# EAGLE design ColinsBlinkySchematic (EAGLE 9.0.0)
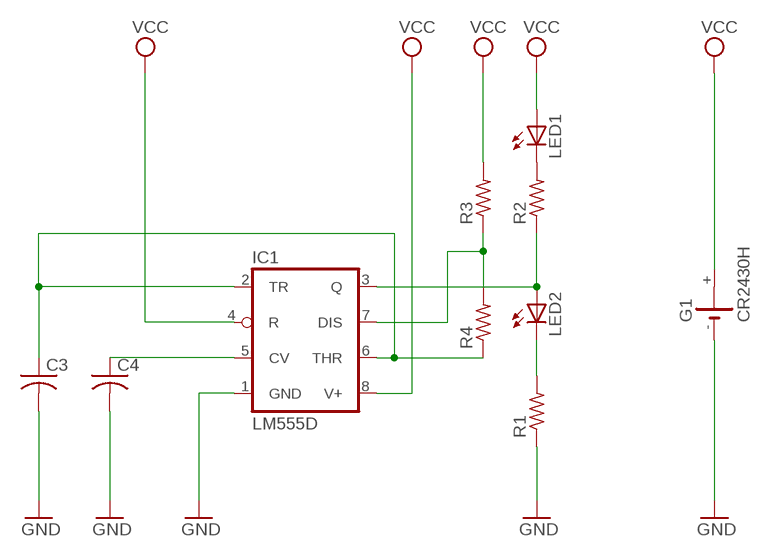
[diagram p0: schematic, sheet 1]

## Parts
C3  C-USC0805  [C0805]
C4  C-USC0805  [C0805]
G1  CR2430H  [CR2430H]
IC1  LM555D  [SO08]
LED1  LED5MM  [LED5MM]
LED2  LED5MM  [LED5MM]
R1  R-US_R0805  [R0805]
R2  R-US_R0805  [R0805]
R3  R-US_R0805  [R0805]
R4  R-US_R0805  [R0805]

## Nets
GND: C3.2 C4.2 G1.- IC1.1(GND) R1.1
N$1: IC1.3(Q) LED2.A R2.1
N$2: LED2.K(C) R1.2
N$4: IC1.7(DIS) R3.1 R4.2
N$5: C4.1 IC1.5(CV)
N$6: C3.1 IC1.2(TR) IC1.6(THR) R4.1
N$8: LED1.K(C) R2.2
VCC: G1.+ IC1.4(R) IC1.8(V+) LED1.A R3.2
Unconnected: G1.+@1(+)

## Library data of the parts
C3 C4 = resistor:C-US: CAPACITOR, American symbol
G1 = battery:CR2430H: LI BATTERY Varta
IC1 = linear:*555: TIMER
LED1 LED2 = led:LED: LED OSRAM: - CHIPLED LG R971, LG N971, LY N971, LG Q971, LY Q971, LO R971, LY R971 LH N974, LH R974 LS Q976, LO Q976, LY Q976 LO Q996 - Hyper CHIPLED LW Q18S LB Q993, LB Q99A, LB R99A - SideLED LS A670, LO A670, LY A670, LG A670, LP A670 LB A673, LV A673, LT A673, LW A673 LH A674 LY A675 LS A676, LA A676, LO A676, LY A676, LW A676 LS A679, LY A679, LG A679 - Hyper Micro SIDELED® LS Y876, LA Y876, LO Y876, LY Y876 LT Y87S - SmartLED LW L88C, LW L88S LB L89C, LB L89S, LG L890 LS L89K, LO L89K, LY L89K LS L896, LA L896, LO L896, LY L896 - TOPLED LS T670, LO T670, LY T670, LG T670, LP T670 LSG T670, LSP T670, LSY T670, LOP T670, LYG T670 LG T671, LOG T671, LSG T671 LB T673, LV T673, LT T673, LW T673 LH T674 LS T676, LA T676, LO T676, LY T676, LB T676, LH T676, LSB T676, LW T676 LB T67C, LV T67C, LT T67C, LS T67K, LO T67K, LY T67K, LW E67C LS E67B, LA E67B, LO E67B, LY E67B, LB E67C, LV E67C, LT E67C LW T67C LS T679, LY T679, LG T679 LS T770, LO T770, LY T770, LG T770, LP T770 LB T773, LV T773, LT T773, LW T773 LH T774 LS E675, LA E675, LY E675, LS T675 LS T776, LA T776, LO T776, LY T776, LB T776 LHGB T686 LT T68C, LB T68C - Hyper Mini TOPLED® LB M676 - Mini TOPLED Santana® LG M470 LS M47K, LO M47K, LY M47K Source: http://www.osram.convergy.de LUXEON: - LUMILED® LXK2-PW12-R00, LXK2-PW12-S00, LXK2-PW14-U00, LXK2-PW14-V00 LXK2-PM12-R00, LXK2-PM12-S00, LXK2-PM14-U00 LXK2-PE12-Q00, LXK2-PE12-R00, LXK2-PE12-S00, LXK2-PE14-T00, LXK2-PE14-U00 LXK2-PB12-K00, LXK2-PB12-L00, LXK2-PB12-M00, LXK2-PB14-N00, LXK2-PB14-P00, LXK2-PB14-Q00 LXK2-PR12-L00, LXK2-PR12-M00, LXK2-PR14-Q00, LXK2-PR14-R00 LXK2-PD12-Q00, LXK2-PD12-R00, LXK2-PD12-S00 LXK2-PH12-R00, LXK2-PH12-S00 LXK2-PL12-P00, LXK2-PL12-Q00, LXK2-PL12-R00 Source: www.luxeon.com KINGBRIGHT: KA-3528ASYC Source: www.kingbright.com
R1-R4 = rcl:R-US_: RESISTOR, American symbol; SPICEPREFIX: R

## Board
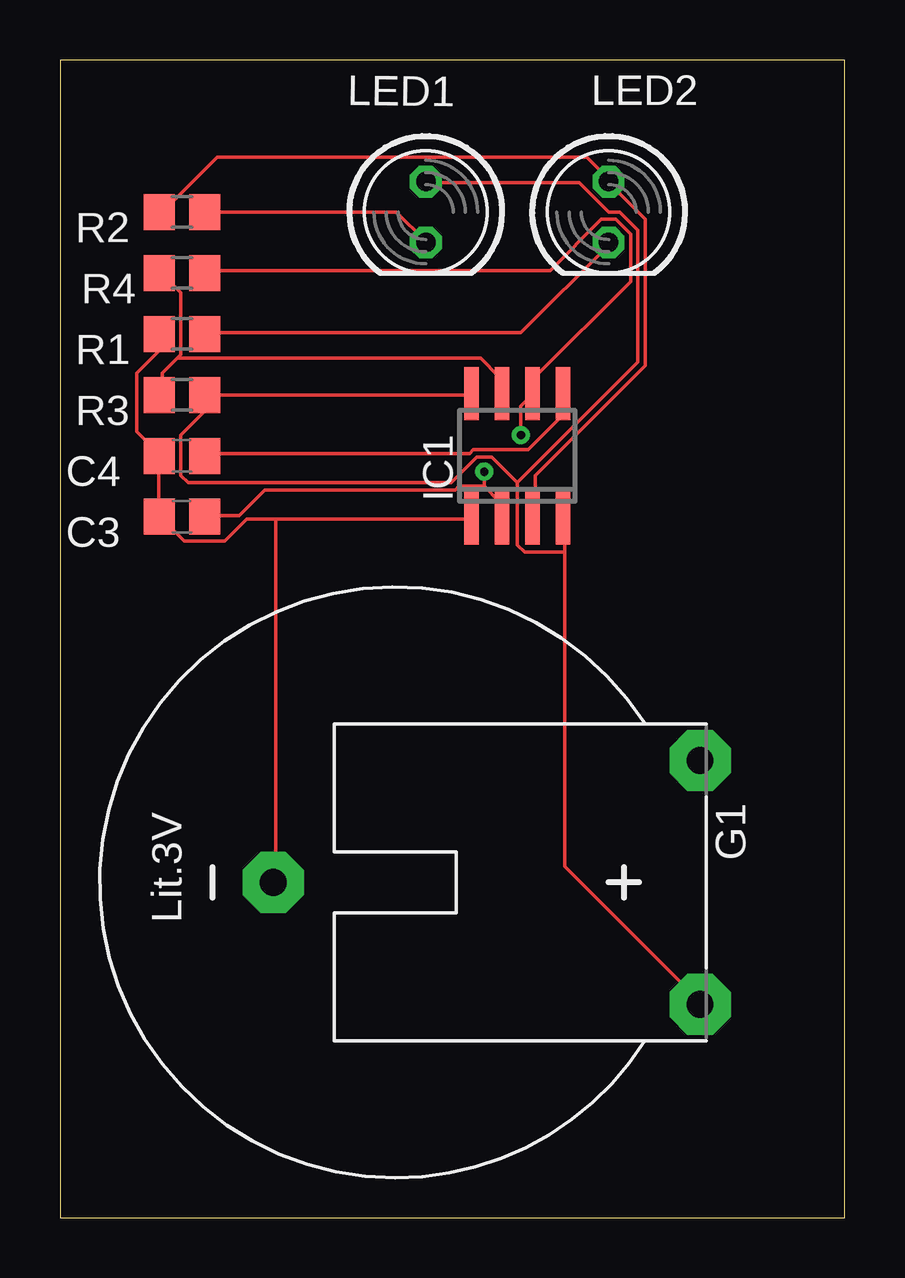
[diagram p1: board, top side]
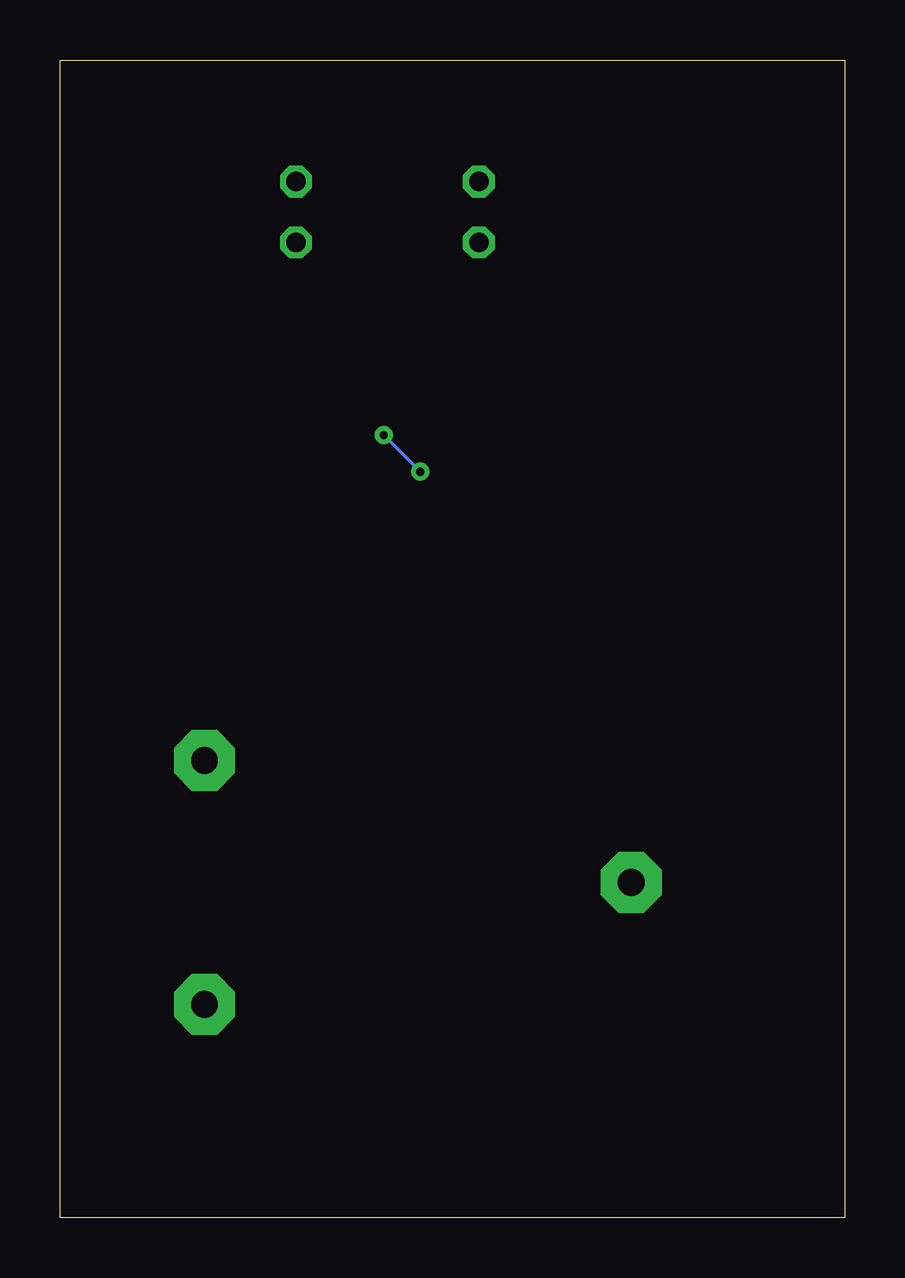
[diagram p2: board, bottom side, seen from below]

Size 32.69 x 48.25 mm. Coordinates in mm from the lower left corner, seen from the top.
Outline: 0,0 32.69,0 32.69,48.25 0,48.25 0,0
Copper layers (1*16): Top 0.035mm / dielectric 1.5mm / Bottom 0.035mm
Design rules "default": minimum track width 6mil, minimum drill 0.35mm, track to track 6mil, track to pad 6mil, pad to pad 6mil, via to via 6mil, smd to smd 6mil, copper to edge 40mil, drill to drill 6mil, minimum pad ring 10mil, minimum via ring 8mil, stop-mask expansion 4mil, vias tented up to drill 0mil, thermal gap 10mil

### Footprints (pad centres in the part's own frame; a part is rotated, then mirrored left to right if it is on the bottom)
C0805 = smd 1.3 x 1.5: 1 -0.95,0; 2 0.95,0
CR2430H = drill 1.118 pad 2.54 octagon: + 5.08,12.7; +@1 -5.08,12.7; - 0,-5.08
SO08 = smd 0.6 x 2.2: 1 -1.905,-2.6; 2 -0.635,-2.6; 3 0.635,-2.6; 4 1.905,-2.6; 5 1.905,2.6; 6 0.635,2.6; 7 -0.635,2.6; 8 -1.905,2.6
LED5MM = drill 0.813 octagon: A -1.27,0; K 1.27,0
R0805 = smd 1.3 x 1.5: 1 -0.95,0; 2 0.95,0

### Placement (x,y rotation side)
C3  5.08,29.21 180 top
C4  5.08,31.75 180 top
G1  13.97,13.97 270 top
IC1  19.05,31.75 0 top
LED1  15.24,41.91 270 top
LED2  22.86,41.91 270 top
R1  5.08,36.83 0 top
R2  5.08,41.91 0 top
R3  5.08,34.29 0 top
R4  5.08,39.37 180 top

### Tracks (layer width: path | path; a pad name or v marks a point on that pad's centre or on a via)
GND
  Top 0.152: R1.1 4.12,36.73 4.12,36.12 3.2,35.2 3.2,32.77 4.12,31.85 C4.2 4.12,31.7 4.12,29.26 C3.2 4.27,29.11 5.18,28.19 6.86,28.19 7.77,29.11 8.99,29.11 | 8.99,29.11 17.07,29.11 IC1.1 | 8.99,29.11 8.99,14.02 G1.-
N$1
  Top 0.152: R2.1 4.27,41.91 6.55,44.2 21.95,44.2 22.86,43.28 LED2.A 22.86,43.13 24.38,41.6 24.38,35.51 19.81,30.94 19.81,29.26 IC1.3
N$2
  Top 0.152: R1.2 6.1,36.88 19.2,36.88 22.86,40.54 LED2.K
N$4
  Top 0.152: 4.88,35.81 5.03,35.97 5.03,38.56 4.27,39.32 R4.2 | 4.88,35.81 4.27,35.2 4.27,34.29 R3.1 | 4.88,35.81 17.53,35.81 18.29,35.05 18.29,34.44 IC1.7
N$5
  Top 0.152: C4.1 6.1,31.85 17.07,31.85 17.22,32 19.51,32 20.88,33.38 20.88,34.29 IC1.5
N$6  (via drill 0.35)
  Top 0.152: 17.68,30.48 16.61,30.48 16.46,30.33 8.53,30.33 7.47,29.26 6.1,29.26 C3.1 | 17.68,30.48 18.29,29.87 18.29,29.26 IC1.2 | R4.1 6.1,39.47 20.42,39.47 22.55,41.6 23.16,41.6 23.77,41 23.77,39.01 19.81,35.05 19.81,34.44 IC1.6 19.66,34.29 19.2,33.83 v19.2,32.61 | v17.68,31.09 17.68,30.48
  Bottom 0.152: v19.2,32.61 v17.68,31.09
N$8
  Top 0.152: R2.2 14.02,41.91 15.24,40.69 LED1.K
VCC
  Top 0.152: IC1.8 17.07,34.29 R3.2 5.94,34.29 5.94,33.53 5.03,32.61 5.03,30.94 5.33,30.63 16.31,30.63 17.37,31.7 17.98,31.7 19.05,30.63 | 21.03,27.74 21.03,14.63 26.67,8.99 G1.+ | 21.03,27.74 21.03,29.11 IC1.4 | 19.05,30.63 24.08,35.66 24.08,41.15 23.32,41.91 22.86,41.91 21.64,43.13 15.24,43.13 LED1.A | 19.05,30.63 19.05,28.04 19.36,27.74 21.03,27.74